# Altium schematic sheet E-Candle.SchDoc: E-Candle TestBoard
size A4; DrawnBy: BossFish; Revision: Test/v0.2; SheetNumber: 1; SheetTotal: 4
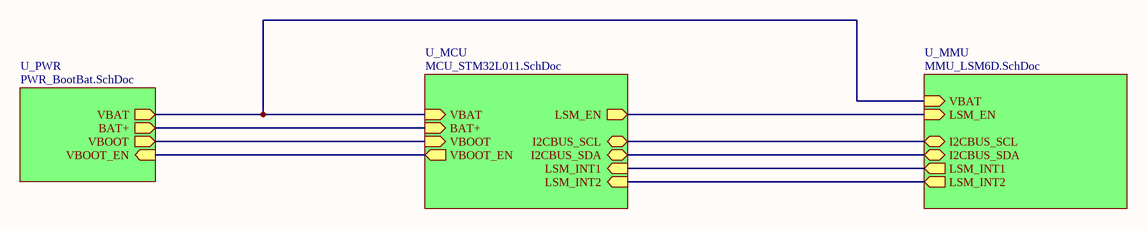
[diagram p0: E-Candle.SchDoc]

## Sub-sheets
U_MCU = MCU_STM32L011.SchDoc: I2CBUS_SCL (bidir), VBAT (in), VBOOT_EN (out), VBOOT (in), I2CBUS_SDA (bidir), LSM_INT1 (in), LSM_INT2 (in), LSM_EN (out), BAT+ (in)
U_MMU = MMU_LSM6D.SchDoc: LSM_EN (in), I2CBUS_SCL (bidir), I2CBUS_SDA (bidir), LSM_INT1 (out), LSM_INT2 (out), VBAT (in)
U_PWR = PWR_BootBat.SchDoc: VBOOT_EN (in), VBAT (out), VBOOT (out), BAT+ (out)

## Nets
(unnamed): sheet U_PWR/VBOOT_EN, sheet U_MCU/VBOOT_EN
(unnamed): sheet U_PWR/VBAT, sheet U_MCU/VBAT, sheet U_MMU/VBAT
(unnamed): sheet U_PWR/VBOOT, sheet U_MCU/VBOOT
(unnamed): sheet U_PWR/BAT+, sheet U_MCU/BAT+
(unnamed): sheet U_MCU/I2CBUS_SCL, sheet U_MMU/I2CBUS_SCL
(unnamed): sheet U_MCU/I2CBUS_SDA, sheet U_MMU/I2CBUS_SDA
(unnamed): sheet U_MCU/LSM_INT1, sheet U_MMU/LSM_INT1
(unnamed): sheet U_MCU/LSM_INT2, sheet U_MMU/LSM_INT2
(unnamed): sheet U_MCU/LSM_EN, sheet U_MMU/LSM_EN